# EAGLE schematic LED Control (EAGLE 7.1.0)
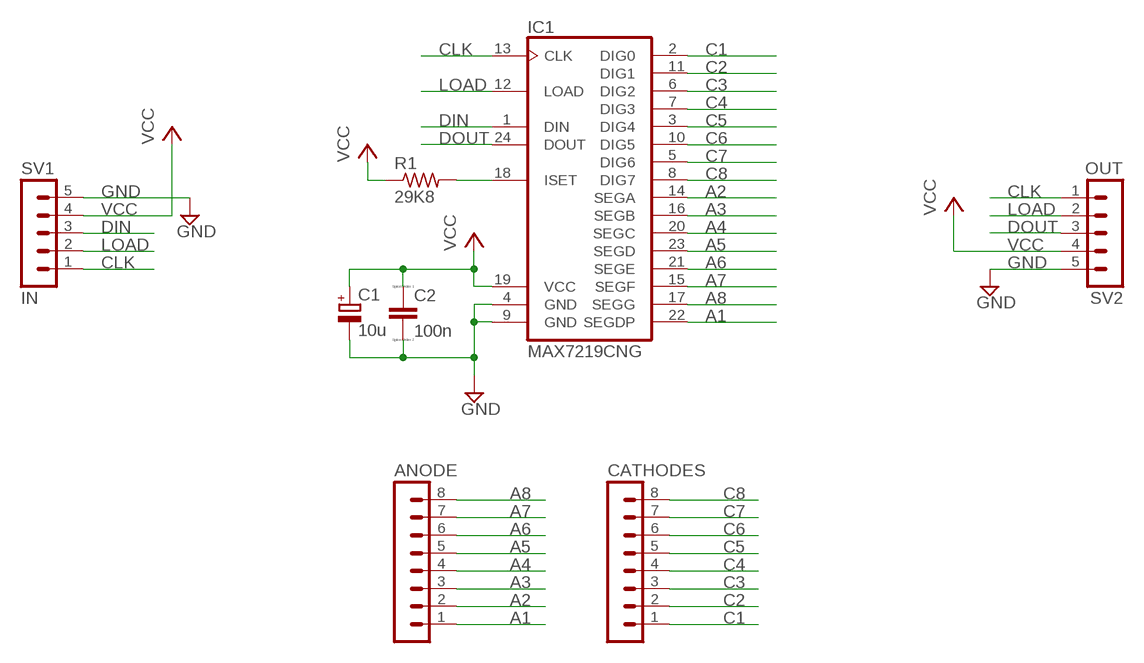
[diagram p0: schematic, sheet 1]

## Parts
ANODE  MA08-1  [MA08-1]
C1  10u  CPOL-EUE2-5  [E2-5]
C2  100n  C-EU025-025X050  [C025-025X050]
CATHODES  MA08-1  [MA08-1]
IC1  MAX7219CNG  [DIL24-3]
R1  29K8  R-US_0204/7  [0204/7]
SV1  IN  MA05-1  [MA05-1]
SV2  OUT  MA05-1  [MA05-1]

## Nets
A1: ANODE.1 IC1.22(SEGDP)
A2: ANODE.2 IC1.14(SEGA)
A3: ANODE.3 IC1.16(SEGB)
A4: ANODE.4 IC1.20(SEGC)
A5: ANODE.5 IC1.23(SEGD)
A6: ANODE.6 IC1.21(SEGE)
A7: ANODE.7 IC1.15(SEGF)
A8: ANODE.8 IC1.17(SEGG)
C1: CATHODES.1 IC1.2(DIG0)
C2: CATHODES.2 IC1.11(DIG1)
C3: CATHODES.3 IC1.6(DIG2)
C4: CATHODES.4 IC1.7(DIG3)
C5: CATHODES.5 IC1.3(DIG4)
C6: CATHODES.6 IC1.10(DIG5)
C7: CATHODES.7 IC1.5(DIG6)
C8: CATHODES.8 IC1.8(DIG7)
CLK: IC1.13(CLK) SV1.1 SV2.1
DIN: IC1.1(DIN) SV1.3
DOUT: IC1.24(DOUT) SV2.3
GND: C1.- C2.2 IC1.4(GND) IC1.9(GND) SV1.5 SV2.5
LOAD: IC1.12(LOAD) SV1.2 SV2.2
N$1: IC1.18(ISET) R1.2
VCC: C1.+ C2.1 IC1.19(VCC) R1.1 SV1.4 SV2.4

## Library data of the parts
ANODE CATHODES = con-lstb:MA08-1: PIN HEADER; OC_FARNELL: unknown; OC_NEWARK: unknown
C1 = resistor:CPOL-EU: POLARIZED CAPACITOR, European symbol
C2 = resistor:C-EU: CAPACITOR, European symbol; SPICEPREFIX: C
IC1 = maxim:MAX7219CNG: LED DISPLAY DRIVER
R1 = resistor:R-US_: RESISTOR, American symbol
SV1 SV2 = con-lstb:MA05-1: PIN HEADER